# Altium schematic sheet project_1_2.SchDoc
size A4; SheetNumber: 1; SheetTotal: 1
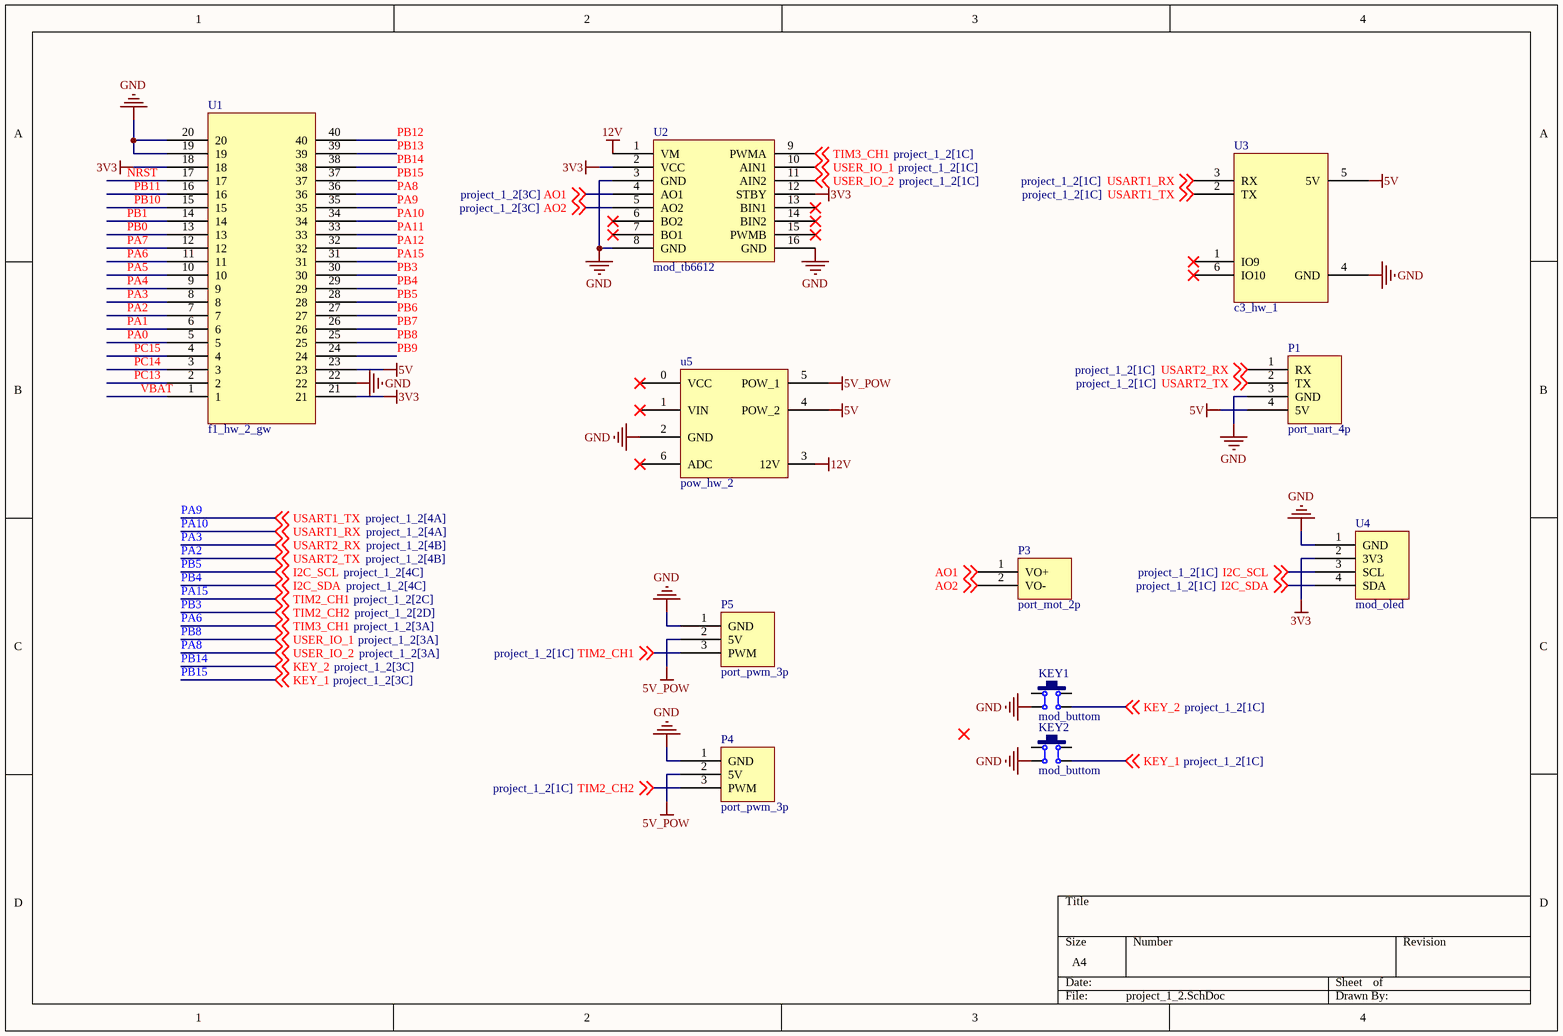
[diagram p0: project_1_2.SchDoc]

## Parts
KEY1  mod_buttom  [MOD_BUTTOM]
KEY2  mod_buttom  [MOD_BUTTOM]
P1  port_uart_4p  [XH2.54_4P]
P3  port_mot_2p  [XH2.54_2P]
P4  port_pwm_3p  [XH2.54_3P]
P5  port_pwm_3p  [XH2.54_3P]
U1  f1_hw_2_gw  [F1_HW_2_GW]
U2  mod_tb6612  [MOD_TB6612]
U3  c3_hw_1  [C3_HW_1]
U4  mod_oled  [mod_oled]
u5  pow_hw_2  [POW_HW_2]

## Nets
3V3: U1.18 U1.21 U2.2(VCC) U2.12(STBY) U4.2(3V3)
5V: P1.4(5V) U1.23 U3.5(5V) u5.4(POW_2)
5V_POW: P4.2(5V) P5.2(5V) u5.5(POW_1)
12V: U2.1(VM)
GND: KEY1.4 KEY2.4 P1.3(GND) P4.1(GND) P5.1(GND) U1.19 U1.20 U1.22 U2.3(GND) U2.8(GND) U2.16(GND) U3.4(GND) U4.1(GND) u5.2(GND)
AO1: P3.1(VO+) U2.4(AO1) ; off-sheet AO1
AO2: P3.2(VO-) U2.5(AO2) ; off-sheet AO2
NRST: U1.17
PA0: U1.5
PA1: U1.6
PA2: P1.2(TX) U1.7 ; off-sheet USART2_TX  [also labelled USART2_TX]
PA3: P1.1(RX) U1.8 ; off-sheet USART2_RX  [also labelled USART2_RX]
PA4: U1.9
PA5: U1.10
PA6: U1.11 U2.9(PWMA) ; off-sheet TIM3_CH1  [also labelled TIM3_CH1]
PA7: U1.12
PA8: U1.36 U2.11(AIN2) ; off-sheet USER_IO_2  [also labelled USER_IO_2]
PA9: U1.35 U3.2(TX) ; off-sheet USART1_TX  [also labelled USART1_TX]
PA10: U1.34 U3.3(RX) ; off-sheet USART1_RX  [also labelled USART1_RX]
PA11: U1.33
PA12: U1.32
PA15: P5.3(PWM) U1.31 ; off-sheet TIM2_CH1  [also labelled TIM2_CH1]
PB0: U1.13
PB1: U1.14
PB3: P4.3(PWM) U1.30 ; off-sheet TIM2_CH2  [also labelled TIM2_CH2]
PB4: U1.29 U4.4(SDA) ; off-sheet I2C_SDA  [also labelled I2C_SDA]
PB5: U1.28 U4.3(SCL) ; off-sheet I2C_SCL  [also labelled I2C_SCL]
PB6: U1.27
PB7: U1.26
PB8: U1.25 U2.10(AIN1) ; off-sheet USER_IO_1  [also labelled USER_IO_1]
PB9: U1.24
PB10: U1.15
PB11: U1.16
PB12: U1.40
PB13: U1.39
PB14: KEY1.3 U1.38 ; off-sheet KEY_2  [also labelled KEY_2]
PB15: KEY2.3 U1.37 ; off-sheet KEY_1  [also labelled KEY_1]
PC13: U1.2
PC14: U1.3
PC15: U1.4
VBAT: U1.1

Not connected (* = marked no-connect by the designer): KEY1 1 2; KEY2 1 2; U2 6(BO2)* 7(BO1)* 13(BIN1)* 14(BIN2)* 15(PWMB)*; U3 1(IO9)* 6(IO10)*; u5 0(VCC)* 1(VIN)* 3(12V) 6(ADC)*

## Notes on the sheet
- Labels drawn without touching a wire or pin: 12V

## Library data of the parts
KEY1 KEY2 = mod_buttom: 6*6*4.3按键
P1 = port_uart_4p: 串口接口/SPP蓝牙模块 / XH2.54弯排针4p/4p排母
P3 = port_mot_2p: 开环直流电机接口 / XH2.54弯排针2p
P4 P5 = port_pwm_3p: 舵机接口 / XH2.54弯排针3p
U2 = mod_tb6612: TB6612模块 / 8p排母*2
U3 = c3_hw_1: ESP32C3蓝牙模块 / 6p排母
U4 = mod_oled: 外购屏幕模块
u5 = pow_hw_2: 两路升降压电源模块 / 6p排母*2